# Altium schematic sheet GainCHR.SchDoc
size A4
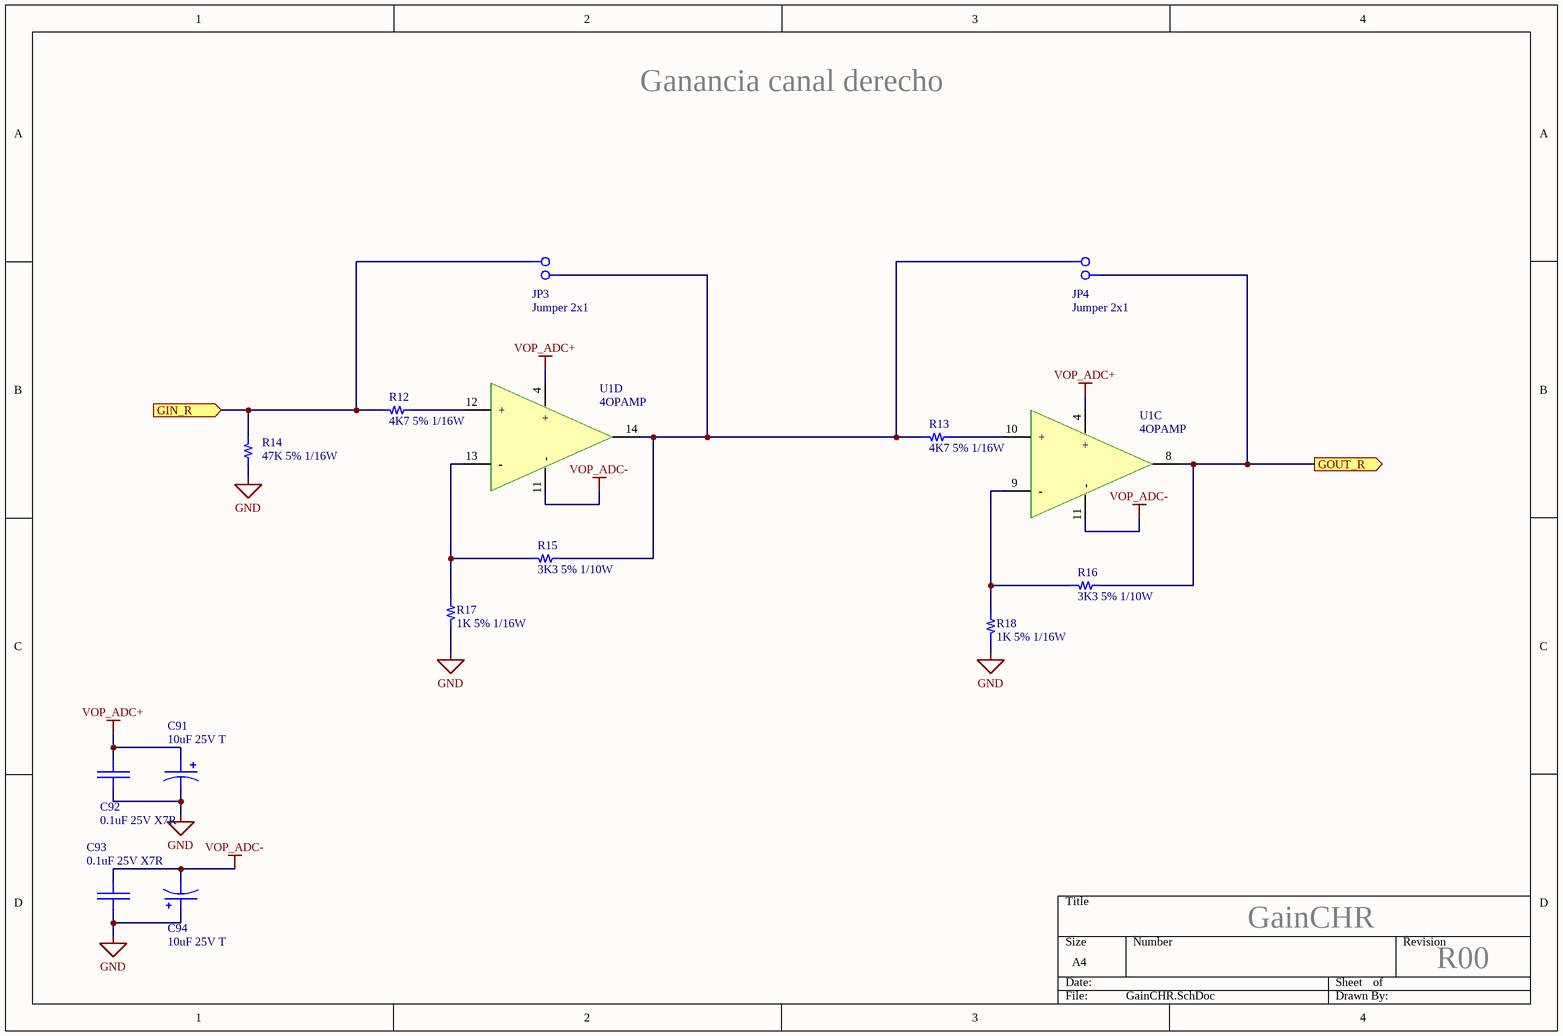
[diagram p0: GainCHR.SchDoc]

## Parts
C91  10uF 25V T  [TANT]
C92  0.1uF 25V X7R  [C_0805]
C93  0.1uF 25V X7R  [C_0805]
C94  10uF 25V T  [TANT]
JP3  Jumper 2x1  [Conn_2_1]
JP4  Jumper 2x1  [Conn_2_1]
R12  4K7 5% 1/16W  [R_0805]
R13  4K7 5% 1/16W  [R_0805]
R14  47K 5% 1/16W  [R_0805]
R15  3K3 5% 1/10W  [R_0805]
R16  3K3 5% 1/10W  [R_0805]
R17  1K 5% 1/16W  [R_0805]
R18  1K 5% 1/16W  [R_0805]
U1  4OPAMP  [SOIC14]  (parts C,D of 4)

## Ports
GIN_R (in), GOUT_R (out)

## Nets
GND: C91.2 C92.2 C93.2 C94.1 R14.1 R17.2 R18.2
VOP_ADC+: C91.1 C92.1 U1.4(+)
VOP_ADC-: C93.1 C94.2 U1.11(-)
GIN_R: JP3.1 R12.2 R14.2 ; port GIN_R
GOUT_R: JP4.2 R16.1 U1.8(OUT) ; port GOUT_R
NetJP3_2: JP3.2 JP4.1 R13.2 R15.1 U1.14(OUT)
NetR12_1: R12.1 U1.12(+)
NetR13_1: R13.1 U1.10(+)
NetR15_2: R15.2 R17.1 U1.13(-)
NetR16_2: R16.2 R18.1 U1.9(-)

## Notes on the sheet
- Ganancia canal derecho
- GainCHR
- R00

## Library data of the parts
C91 C94 = CapaPol: Capacitor polarizado; Encapsulado: TH; Cod. Proveedor: -; Proveedor: -
C92 C93 = Capacitor: Capacitor de placas paralelas; Cod. Proveedor: CA3289100; Encapsulado: 0603; Proveedor: Elemon
JP3 JP4 = Jumper 2x1: Cod. Proveedor: CO4921360; Proveedor: Elemon
R12 = Resistor: Resistencia; Encapsulado: 0805; Proveedor: Elemon; Cod. Proveedor: RS3896225
R13 = Resistor: Resistencia; Cod. Proveedor: RS3896225; Proveedor: Elemon; Encapsulado: 0805
R14 = Resistor: Resistencia; Encapsulado: 0805; Cod. Proveedor: -; Proveedor: -
R15 R16 = Resistor: Resistencia; Cod. Proveedor: RS3896215; Encapsulado: 0805; Proveedor: Elemon
R17 R18 = Resistor: Resistencia; Cod. Proveedor: RS3866185; Encapsulado: 0603; Proveedor: Elemon
U1 = 4OPAMP: Integrado con 4 operacionales; Cod. Proveedor: -; Proveedor: -; Encapsulado: SOIC14